# EAGLE design norns-shield-211028 (EAGLE 7.6.0)

## Sheet 1 of 2
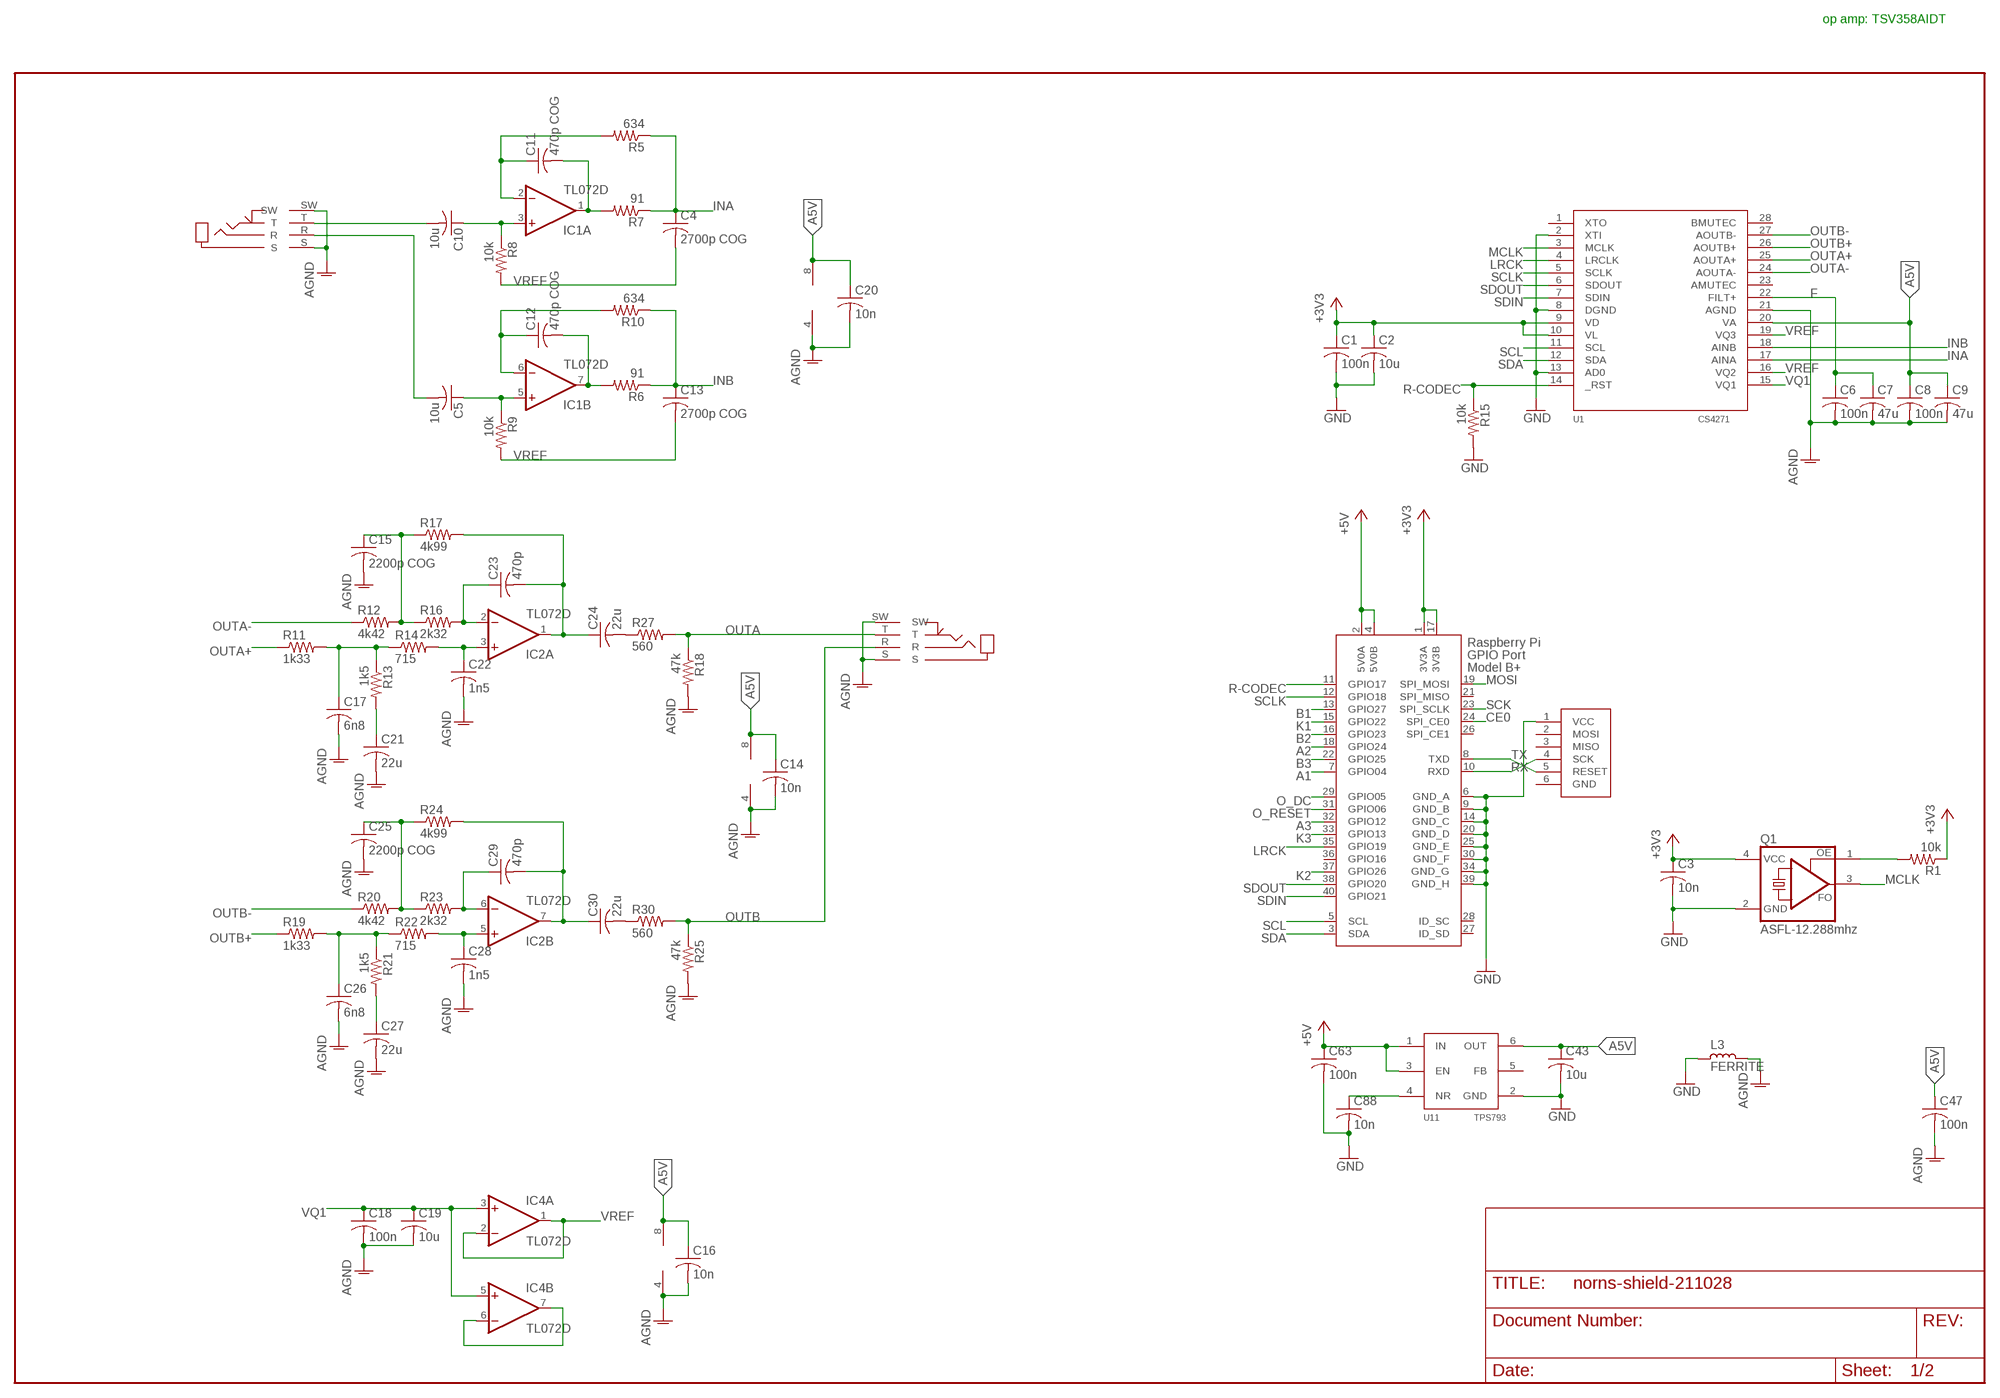
[diagram p0: schematic, sheet 1]

### Parts
C1  100n  C-USC0603  [C0603]
C2  10u  C-USC0805  [C0805]
C3  10n  C-USC0603  [C0603]
C4  2700p COG  C-USC0603  [C0603]
C5  10u  C-USC0805  [C0805]
C6  100n  C-USC0603  [C0603]
C7  47u  C-USC1206  [C1206]
C8  100n  C-USC0603  [C0603]
C9  47u  C-USC1206  [C1206]
C10  10u  C-USC0805  [C0805]
C11  470p COG  C-USC0603  [C0603]
C12  470p COG  C-USC0603  [C0603]
C13  2700p COG  C-USC0603  [C0603]
C14  10n  C-USC0603  [C0603]
C15  2200p COG  C-USC0603  [C0603]
C16  10n  C-USC0603  [C0603]
C17  6n8  C-USC0603  [C0603]
C18  100n  C-USC0603  [C0603]
C19  10u  C-USC0805  [C0805]
C20  10n  C-USC0603  [C0603]
C21  22u  C-USC1206  [C1206]
C22  1n5  C-USC0603  [C0603]
C23  470p  C-USC0603  [C0603]
C24  22u  C-USC1206  [C1206]
C25  2200p COG  C-USC0603  [C0603]
C26  6n8  C-USC0603  [C0603]
C27  22u  C-USC1206  [C1206]
C28  1n5  C-USC0603  [C0603]
C29  470p  C-USC0603  [C0603]
C30  22u  C-USC1206  [C1206]
C43  10u  C-USC0805  [C0805]
C47  100n  C-USC0603  [C0603]
C63  100n  C-USC0603  [C0603]
C88  10n  C-USC0603  [C0603]
IC1  TL072D  [SO08]
IC2  TL072D  [SO08]
IC4  TL072D  [SO08]
J3  ISP-ROW  [ISP-ROW]
J-IN  JACK-TRS-SW  [JACK4832.2330]
J-OUT  JACK-TRS-SW  [JACK4832.2330]
L3  FERRITE  L_0805  [L0805]
Q1  ASFL-12.288mhz  ASFL  [ASF]
R1  10k  R-US_R0603  [R0603]
R5  634  R-US_R0603  [R0603]
R6  91  R-US_R0603  [R0603]
R7  91  R-US_R0603  [R0603]
R8  10k  R-US_R0603  [R0603]
R9  10k  R-US_R0603  [R0603]
R10  634  R-US_R0603  [R0603]
R11  1k33  R-US_R0603  [R0603]
R12  4k42  R-US_R0603  [R0603]
R13  1k5  R-US_R0603  [R0603]
R14  715  R-US_R0603  [R0603]
R15  10k  R-US_R0603  [R0603]
R16  2k32  R-US_R0603  [R0603]
R17  4k99  R-US_R0603  [R0603]
R18  47k  R-US_R0603  [R0603]
R19  1k33  R-US_R0603  [R0603]
R20  4k42  R-US_R0603  [R0603]
R21  1k5  R-US_R0603  [R0603]
R22  715  R-US_R0603  [R0603]
R23  2k32  R-US_R0603  [R0603]
R24  4k99  R-US_R0603  [R0603]
R25  47k  R-US_R0603  [R0603]
R27  560  R-US_R0603  [R0603]
R30  560  R-US_R0603  [R0603]
U1  CS4271  [SOP28]
U11  TPS793  [SSOP6]
X1  RASPI_BOARD_B+#_E3  [RASPI_BOARD_B+_EDGES_3DRILL]

### Nets
+3V3: C1.1 C2.1 C3.1 Q1.4(VCC) R1.1 U1.9(VD) U1.10(VL) X1.1(3V3A) X1.17(3V3B) ; also sheet 2
+5V: C63.1 U11.1(IN) U11.3(EN) X1.2(5V0A) X1.4(5V0B)
A1: X1.7(GPIO04) ; also sheet 2
A2: X1.18(GPIO24) ; also sheet 2
A3: X1.32(GPIO12) ; also sheet 2
A5V: C8.1 C9.1 C14.1 C16.1 C20.1 C43.1 C47.1 IC1.8(P:V+) IC2.8(P:V+) IC4.8(P:V+) U1.20(VA) U11.6(OUT)
AGND: C6.2 C7.2 C8.2 C9.2 C14.2 C15.2 C16.2 C17.2 C18.2 C19.2 C20.2 C21.2 C22.2 C25.2 C26.2 C27.2 C28.2 C47.2 IC1.4(P:V-) IC2.4(P:V-) IC4.4(P:V-) J-IN.S J-IN.SW J-OUT.S J-OUT.SW L3.1 R18.2 R25.2 U1.21(AGND)
B1: X1.13(GPIO27) ; also sheet 2
B2: X1.16(GPIO23) ; also sheet 2
B3: X1.22(GPIO25) ; also sheet 2
CE0: X1.24(SPI_CE0) ; also sheet 2
F: C6.1 C7.1 U1.22(FILT+)
GND: C1.2 C2.2 C3.2 C43.2 C63.2 C88.2 J3.1(VCC) L3.2 Q1.2(GND) R15.2 U1.2(XTI) U1.8(DGND) U1.13(AD0) U11.2(GND) X1.6(GND_A) X1.9(GND_B) X1.14(GND_C) X1.20(GND_D) X1.25(GND_E) X1.30(GND_F) X1.34(GND_G) X1.39(GND_H) ; also sheet 2
INA: C4.1 R5.1 R7.1 U1.17(AINA)
INB: C13.1 R6.1 R10.1 U1.18(AINB)
K1: X1.15(GPIO22) ; also sheet 2
K2: X1.37(GPIO26) ; also sheet 2
K3: X1.33(GPIO13) ; also sheet 2
LRCK: U1.4(LRCLK) X1.35(GPIO19)
MCLK: Q1.3(FO) U1.3(MCLK)
MOSI: X1.19(SPI_MOSI) ; also sheet 2
N$1: Q1.1(OE) R1.2
N$4: C11.1 IC1.2(A:-IN) R5.2
N$5: C11.2 IC1.1(A:OUT) R7.2
N$7: C12.1 IC1.6(B:-IN) R10.2
N$8: C10.2 J-IN.T
N$9: C10.1 IC1.3(A:+IN) R8.1
N$10: C12.2 IC1.7(B:OUT) R6.2
N$11: C5.2 J-IN.R
N$12: C5.1 IC1.5(B:+IN) R9.1
N$13: C24.2 R27.1
N$14: C30.2 R30.1
N$15: C26.1 R19.2 R21.1 R22.1
N$16: C17.1 R11.2 R13.1 R14.1
N$17: C21.1 R13.2
N$20: C15.1 R12.2 R16.1 R17.1
N$21: C23.1 IC2.2(A:-IN) R16.2
N$23: C23.2 C24.1 IC2.1(A:OUT) R17.2
N$24: C22.1 IC2.3(A:+IN) R14.2
N$26: IC4.6(B:-IN) IC4.7(B:OUT)
N$29: C27.1 R21.2
N$30: C25.1 R20.2 R23.1 R24.1
N$31: C29.1 IC2.6(B:-IN) R23.2
N$32: C29.2 C30.1 IC2.7(B:OUT) R24.2
N$33: C28.1 IC2.5(B:+IN) R22.2
N$58: C88.1 U11.4(NR)
O_DC: X1.29(GPIO05) ; also sheet 2
O_RESET: X1.31(GPIO06) ; also sheet 2
OUTA: J-OUT.T R18.1 R27.2
OUTA+: R11.1 U1.25(AOUTA+)
OUTA-: R12.1 U1.24(AOUTA-)
OUTB: J-OUT.R R25.1 R30.2
OUTB+: R19.1 U1.26(AOUTB+)
OUTB-: R20.1 U1.27(AOUTB-)
R-CODEC: R15.1 U1.14(_RST) X1.11(GPIO17)
RX: J3.4(SCK) X1.10(RXD)
SCK: X1.23(SPI_SCLK) ; also sheet 2
SCL: U1.11(SCL) X1.5(SCL)
SCLK: U1.5(SCLK) X1.12(GPIO18)
SDA: U1.12(SDA) X1.3(SDA)
SDIN: U1.7(SDIN) X1.40(GPIO21)
SDOUT: U1.6(SDOUT) X1.38(GPIO20)
TX: J3.5(RESET) X1.8(TXD)
VQ1: C18.1 C19.1 IC4.3(A:+IN) IC4.5(B:+IN) U1.15(VQ1)
VREF: C4.2 C13.2 IC4.1(A:OUT) IC4.2(A:-IN) R8.2 R9.2 U1.16(VQ2) U1.19(VQ3)
Unconnected: J3.2(MOSI) J3.3(MISO) J3.6(GND) U1.1(XTO) U1.23(AMUTEC) U1.28(BMUTEC) U11.5(FB) X1.21(SPI_MISO) X1.26(SPI_CE1) X1.27(ID_SD) X1.28(ID_SC) X1.36(GPIO16)

### Notes on the sheet
- op amp: TSV358AIDT

## Sheet 2 of 2
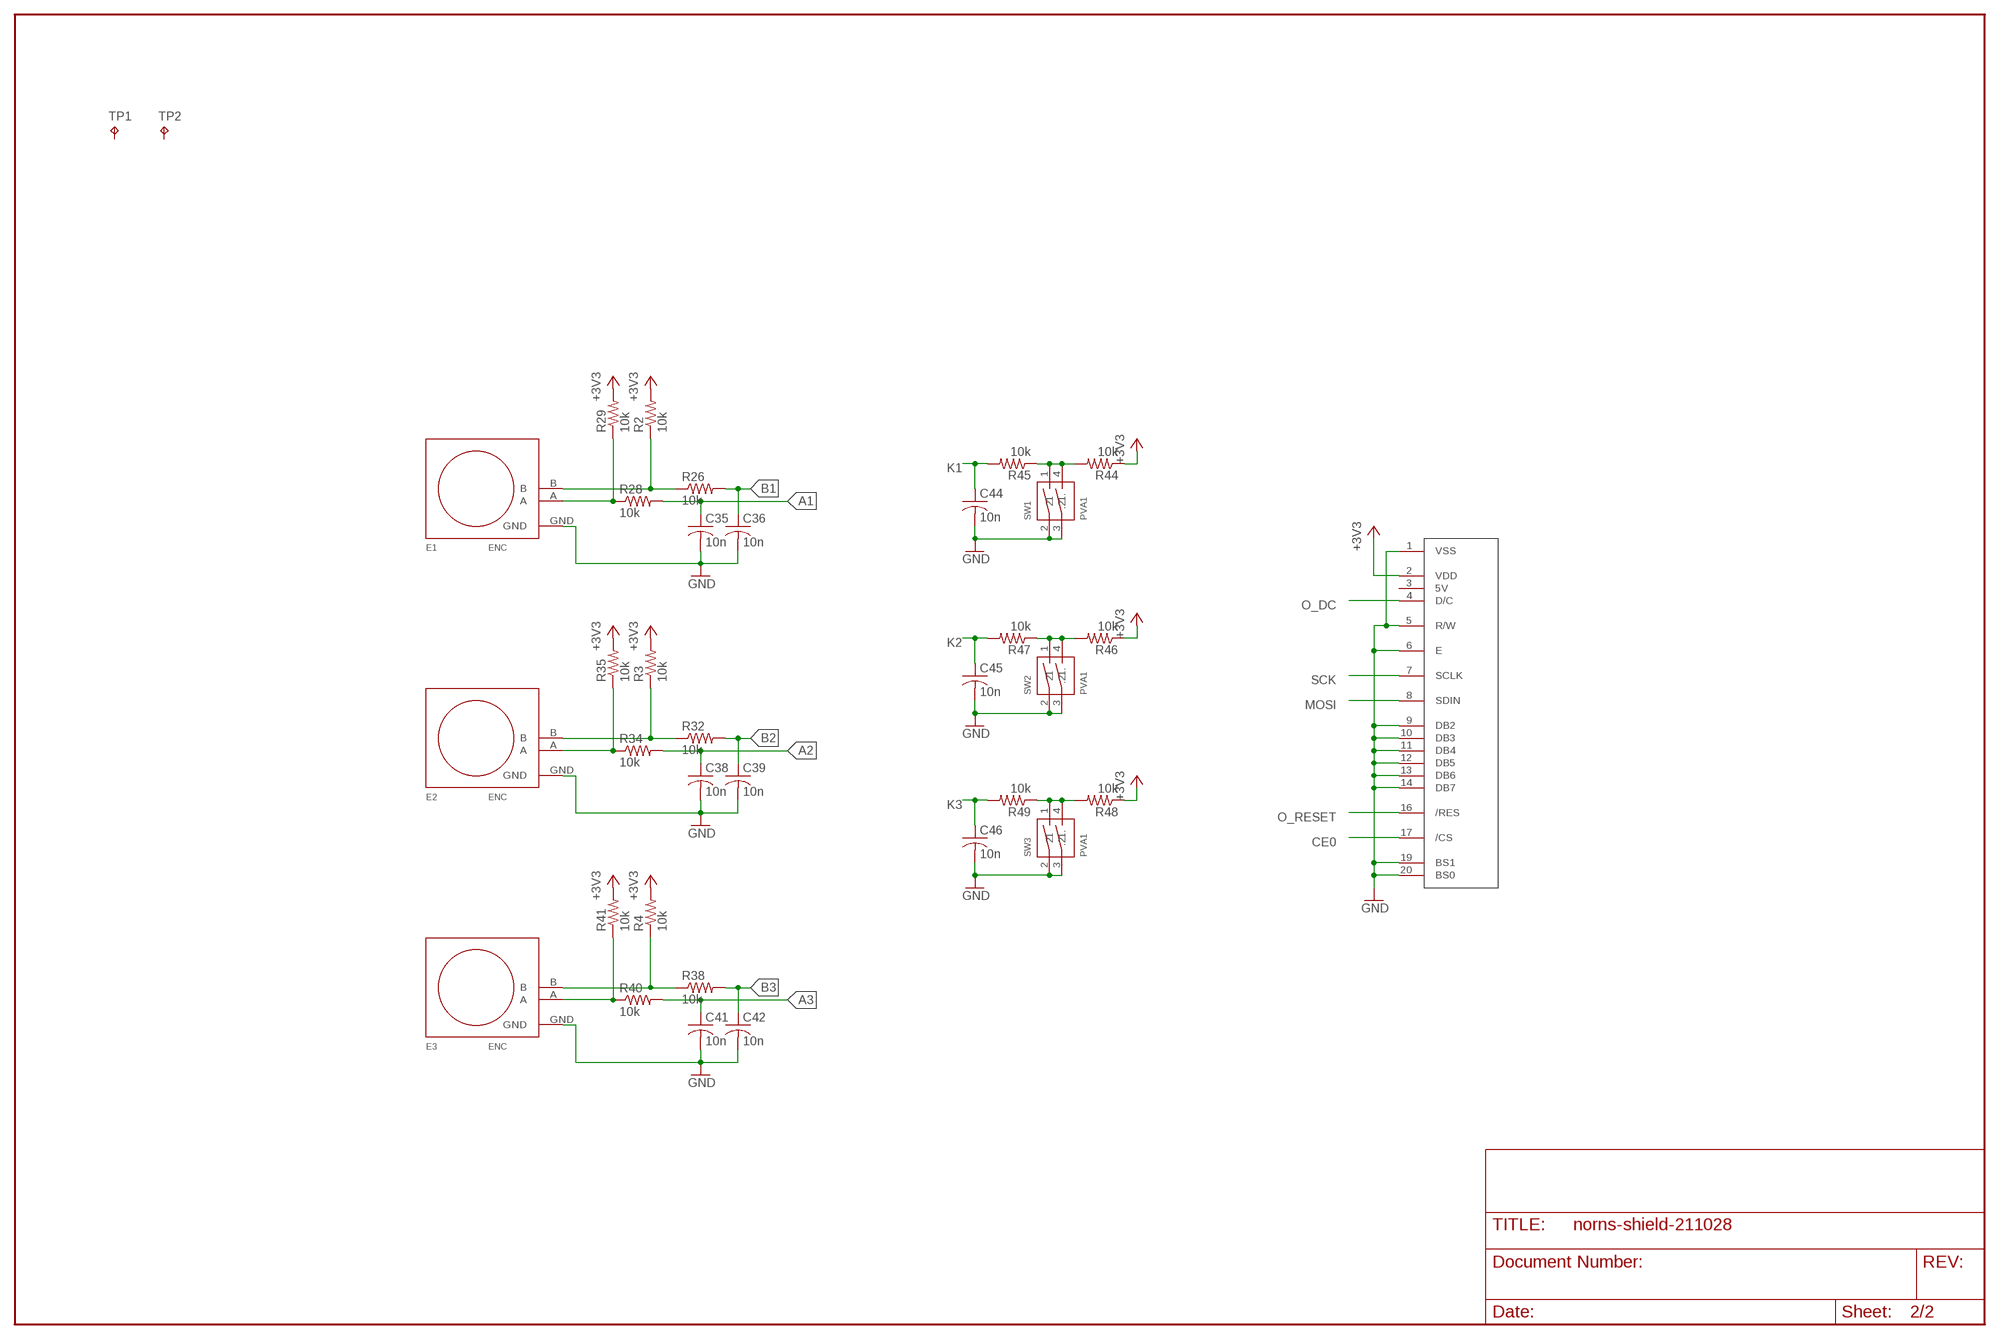
[diagram p1: schematic, sheet 2]

### Parts
C35  10n  C-USC0603  [C0603]
C36  10n  C-USC0603  [C0603]
C38  10n  C-USC0603  [C0603]
C39  10n  C-USC0603  [C0603]
C41  10n  C-USC0603  [C0603]
C42  10n  C-USC0603  [C0603]
C44  10n  C-USC0603  [C0603]
C45  10n  C-USC0603  [C0603]
C46  10n  C-USC0603  [C0603]
E1  ENC  [PEC11RN]
E2  ENC  [PEC11RN]
E3  ENC  [PEC11RN]
R2  10k  R-US_R0603  [R0603]
R3  10k  R-US_R0603  [R0603]
R4  10k  R-US_R0603  [R0603]
R26  10k  R-US_R0603  [R0603]
R28  10k  R-US_R0603  [R0603]
R29  10k  R-US_R0603  [R0603]
R32  10k  R-US_R0603  [R0603]
R34  10k  R-US_R0603  [R0603]
R35  10k  R-US_R0603  [R0603]
R38  10k  R-US_R0603  [R0603]
R40  10k  R-US_R0603  [R0603]
R41  10k  R-US_R0603  [R0603]
R44  10k  R-US_R0603  [R0603]
R45  10k  R-US_R0603  [R0603]
R46  10k  R-US_R0603  [R0603]
R47  10k  R-US_R0603  [R0603]
R48  10k  R-US_R0603  [R0603]
R49  10k  R-US_R0603  [R0603]
SW1  PVA1  [PVA1]
SW2  PVA1  [PVA1]
SW3  PVA1  [PVA1]
TP1  TPB1,27  [B1,27]
TP2  TPB1,27  [B1,27]
U$1  OLED128X64  [OLED-ALEPH]

### Nets
+3V3: R2.2 R3.2 R4.2 R29.2 R35.2 R41.2 R44.1 R46.1 R48.1 U$1.2(VDD) ; also sheet 1
A1: C35.1 R28.2 ; also sheet 1
A2: C38.1 R34.2 ; also sheet 1
A3: C41.1 R40.2 ; also sheet 1
B1: C36.1 R26.2 ; also sheet 1
B2: C39.1 R32.2 ; also sheet 1
B3: C42.1 R38.2 ; also sheet 1
CE0: U$1.17(/CS) ; also sheet 1
GND: C35.2 C36.2 C38.2 C39.2 C41.2 C42.2 C44.2 C45.2 C46.2 E1.GND E2.GND E3.GND SW1.2 SW1.3(1.) SW2.2 SW2.3(1.) SW3.2 SW3.3(1.) U$1.1(VSS) U$1.5(R/W) U$1.6(E) U$1.9(DB2) U$1.10(DB3) U$1.11(DB4) U$1.12(DB5) U$1.13(DB6) U$1.14(DB7) U$1.19(BS1) U$1.20(BS0) ; also sheet 1
K1: C44.1 R45.2 ; also sheet 1
K2: C45.1 R47.2 ; also sheet 1
K3: C46.1 R49.2 ; also sheet 1
MOSI: U$1.8(SDIN) ; also sheet 1
N$2: R44.2 R45.1 SW1.1 SW1.4(.2)
N$3: R46.2 R47.1 SW2.1 SW2.4(.2)
N$6: R48.2 R49.1 SW3.1 SW3.4(.2)
N$18: E1.A R28.1 R29.1
N$19: E1.B R2.1 R26.1
N$22: E2.B R3.1 R32.1
N$25: E2.A R34.1 R35.1
N$27: E3.B R4.1 R38.1
N$28: E3.A R40.1 R41.1
O_DC: U$1.4(D/C) ; also sheet 1
O_RESET: U$1.16(/RES) ; also sheet 1
SCK: U$1.7(SCLK) ; also sheet 1
Unconnected: TP1.TP TP2.TP U$1.3(5V)

## Library data of the parts
C1-C30 C35 C36 C38 C39 C41-C47 C63 C88 = rcl:C-US: CAPACITOR, American symbol
E1-E3 = lines:ENC
IC1 IC2 IC4 = linear:TL072: OP AMP
J3 = monome-inc:ISP-ROW
J-IN J-OUT = lines:JACK-TRS-SW
L3 = rc-master-smd:L_: INDUCTOR
Q1 = crystal:ASF*: CRYSTAL CLOCK OSCILLATORS 5.0 Vdc or 3.3 Vdc - LOW PROFILE ULTRA MINIATURE CERAMIC SURFACE MOUNT Source: http://www.abracon.com/Oscillators/asf1-L-L1.pdf; MPN: ASFLM1-50.000MHZ-C-T; OC_FARNELL: 1838931; OC_NEWARK: 99M0411
R1-R30 R32 R34 R35 R38 R40 R41 R44-R49 = rcl:R-US_: RESISTOR, American symbol
SW1-SW3 = monome-inc:PVA1
TP1 TP2 = testpad:TP: Test pad
U1 = lines:CS4271
U11 = lines:TPS793
U$1 = monome_modular:OLED128X64
X1 = raspberrypi_bastelstube_v13:RASPI_BOARD_B+#: Raspberry Pi GPIO connector with markings for the outer dimensions of the Raspberry Pi board model B+ with different sets of drill holes or mounting pads All pins connected

## Board
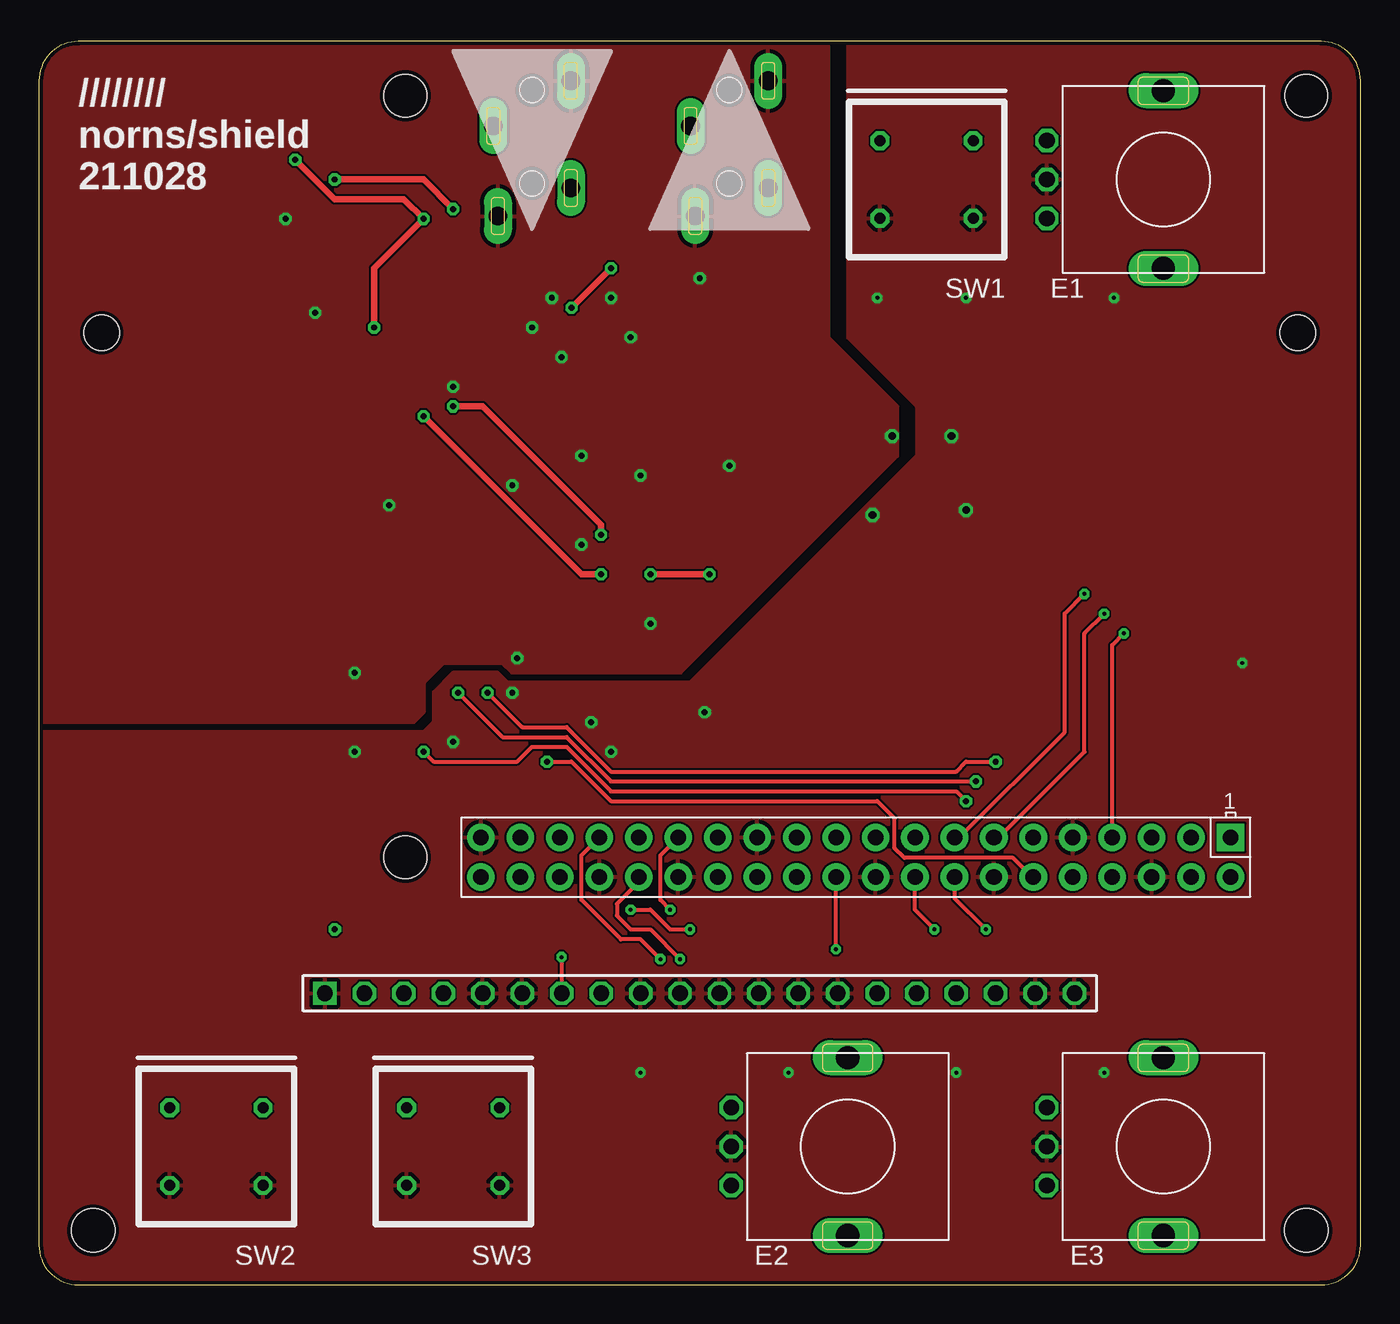
[diagram p2: board, top side]
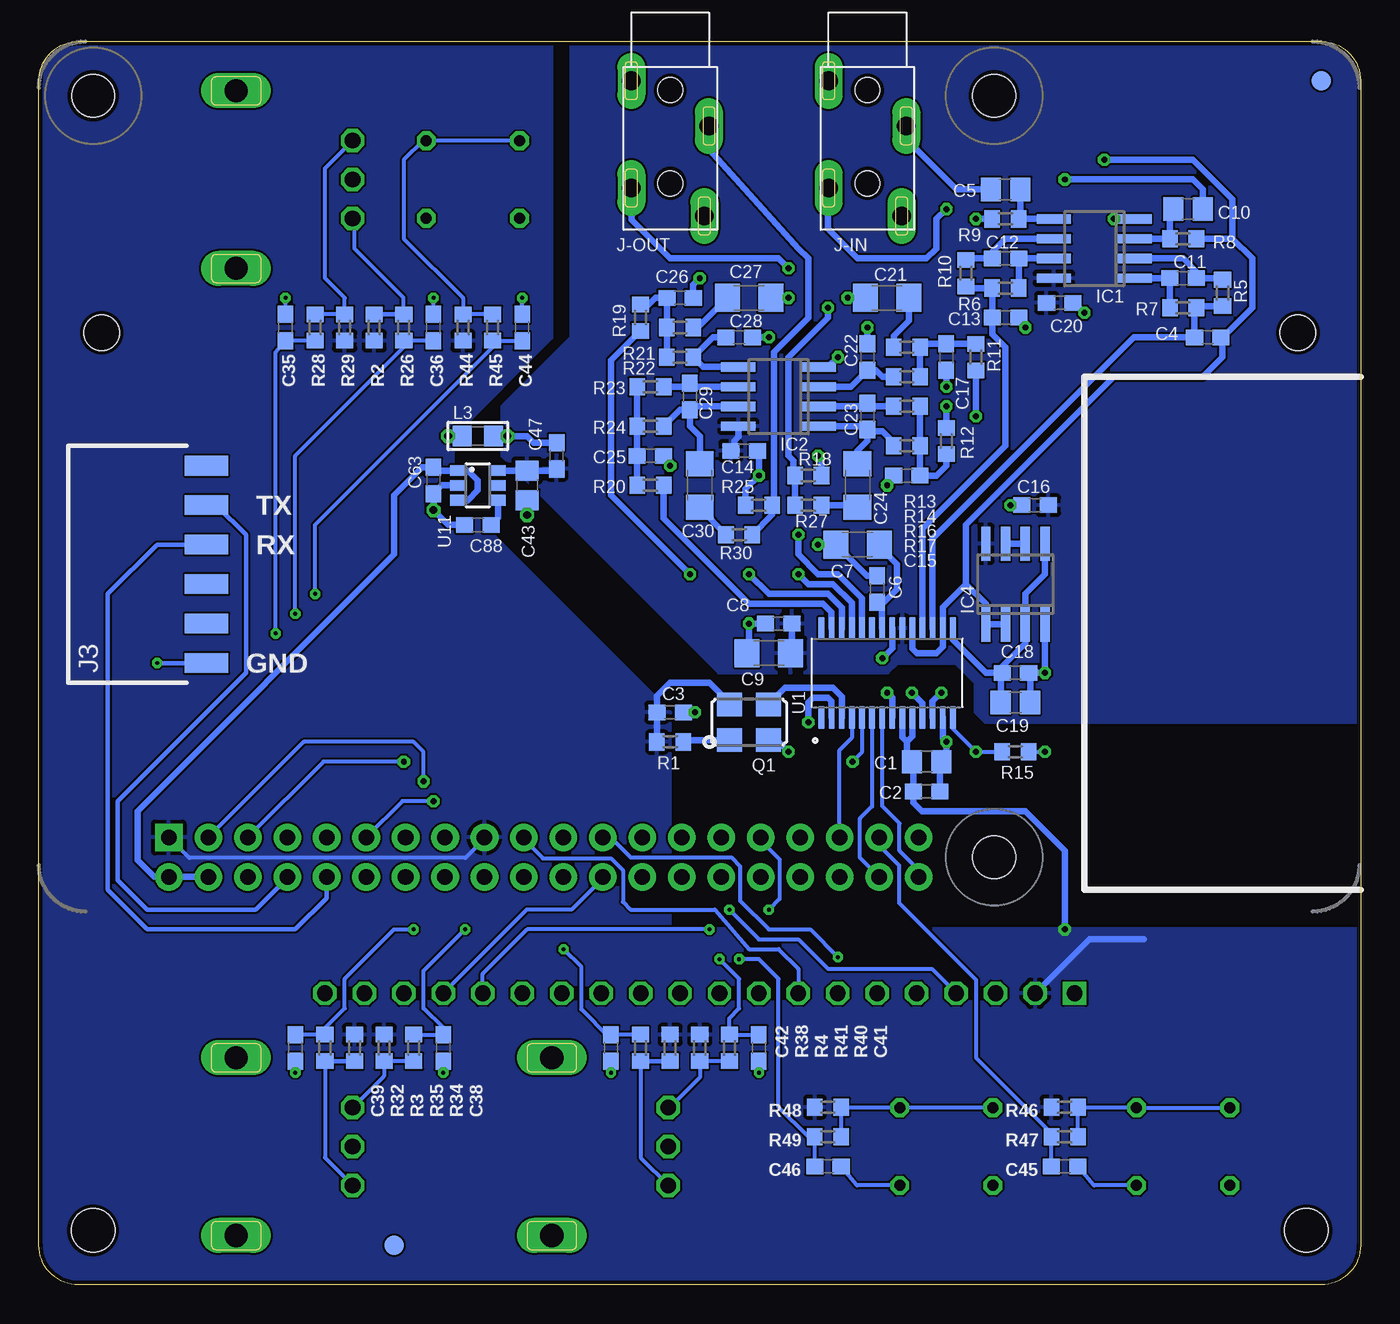
[diagram p3: board, bottom side, seen from below]

Size 85.09 x 80.01 mm. Coordinates in mm from the lower left corner, seen from the top.
Outline: 0,77.47 0,2.54 arc90 2.54,0 82.55,0 arc90 85.09,2.54 85.09,77.47 arc90 82.55,80.01 2.54,80.01 arc90 0,77.47
Copper layers (1*16): Top 0.035mm / dielectric 1.5mm / Bottom 0.035mm
Design rules "default *": minimum track width 8mil, minimum drill 10mil, track to track 5mil, track to pad 5mil, pad to pad 5mil, via to via 5mil, smd to smd 0mil, copper to edge 10mil, drill to drill 8mil, minimum pad ring 10mil, minimum via ring 8mil, stop-mask expansion 4mil, vias tented up to drill 0mil, thermal gap 10mil
Holes 2.8 mm at 81.6,3.49 3.49,3.49

### Footprints (pad centres in the part's own frame; a part is rotated, then mirrored left to right if it is on the bottom)
C0603 = smd 1.1 x 1: 1 -0.85,0; 2 0.85,0
C0805 = smd 1.3 x 1.5: 1 -0.95,0; 2 0.95,0
C1206 = smd 1.6 x 1.8: 1 -1.4,0; 2 1.4,0
PEC11RN = drill 1 octagon: A -2.5,-7.5; B 2.5,-7.5; GND 0,-7.5 | drill 1.5 long: P$1 -5.715,0; P$2 5.715,0
SO08 = smd 0.6 x 2.2: 1 -1.905,-2.6; 2 -0.635,-2.6; 3 0.635,-2.6; 4 1.905,-2.6; 5 1.905,2.6; 6 0.635,2.6; 7 -0.635,2.6; 8 -1.905,2.6
ISP-ROW = smd 1.27 x 2.794: 1 -6.35,0; 2 -3.81,0; 3 -1.27,0; 4 1.27,0; 5 3.81,0; 6 6.35,0
JACK4832.2330 = drill 1.2 long: R -2.5,2.9; S 2.5,0; SW -2.2,8.7; T 2.5,6.9 | hole 1.6: 0,0.6; 0,6.6
L0805 = smd 1.2 x 1.3: 1 -1.016,0; 2 1.016,0
ASF = smd 1.6 x 1.5: 1 -1.25,-1.15; 2 1.25,-1.15; 3 1.25,1.15; 4 -1.25,1.15
R0603 = smd 1 x 1.1: 1 -0.85,0; 2 0.85,0
PVA1 = drill 0.7 octagon: 1 -3,-2.5; 2 -3,2.5; 3 3,2.5; 4 3,-2.5
B1,27 = smd 1.27 x 1.27: TP 0,0
SOP28 = smd 1.49 x 0.41: 1 -2.86,4.225; 2 -2.86,3.575; 3 -2.86,2.925; 4 -2.86,2.275; 5 -2.86,1.625; 6 -2.86,0.975; 7 -2.86,0.325; 8 -2.86,-0.325; 9 -2.86,-0.975; 10 -2.86,-1.625; 11 -2.86,-2.275; 12 -2.86,-2.925; 13 -2.86,-3.575; 14 -2.86,-4.225; 15 2.86,-4.225; 16 2.86,-3.575; 17 2.86,-2.925; 18 2.86,-2.275; 19 2.86,-1.625; 20 2.86,-0.975; 21 2.86,-0.325; 22 2.86,0.325; 23 2.86,0.975; 24 2.86,1.625; 25 2.86,2.275; 26 2.86,2.925; 27 2.86,3.575; 28 2.86,4.225
SSOP6 = smd 0.69 x 0.99: 1 -0.95,-1.3; 2 0,-1.3; 3 0.95,-1.3; 4 0.95,1.3; 5 0,1.3; 6 -0.95,1.3
OLED-ALEPH = drill 1 pad 1.5 square: 1 24.13,21.25 | drill 1 pad 1.5 octagon: 2 21.59,21.25; 3 19.05,21.25; 4 16.51,21.25; 5 13.97,21.25; 6 11.43,21.25; 7 8.89,21.25; 8 6.35,21.25; 9 3.81,21.25; 10 1.27,21.25; 11 -1.27,21.25; 12 -3.81,21.25; 13 -6.35,21.25; 14 -8.89,21.25; 15 -11.43,21.25; 16 -13.97,21.25; 17 -16.51,21.25; 18 -19.05,21.25; 19 -21.59,21.25; 20 -24.13,21.25 | hole 2.286: 38.5,-21.25; -38.5,-21.25
RASPI_BOARD_B+_EDGES_3DRILL = drill 1 pad 1.778 square: 1 8.37,51.23 | drill 1 pad 1.778: 2 8.37,53.77; 3 10.91,51.23; 4 10.91,53.77; 5 13.45,51.23; 6 13.45,53.77; 7 15.99,51.23; 8 15.99,53.77; 9 18.53,51.23; 10 18.53,53.77; 11 21.07,51.23; 12 21.07,53.77; 13 23.61,51.23; 14 23.61,53.77; 15 26.15,51.23; 16 26.15,53.77; 17 28.69,51.23; 18 28.69,53.77; 19 31.23,51.23; 20 31.23,53.77; 21 33.77,51.23; 22 33.77,53.77; 23 36.31,51.23; 24 36.31,53.77; 25 38.85,51.23; 26 38.85,53.77; 27 41.39,51.23; 28 41.39,53.77; 29 43.93,51.23; 30 43.93,53.77; 31 46.47,51.23; 32 46.47,53.77; 33 49.01,51.23; 34 49.01,53.77; 35 51.55,51.23; 36 51.55,53.77; 37 54.09,51.23; 38 54.09,53.77; 39 56.63,51.23; 40 56.63,53.77 | hole 2.75: 3.5,3.5; 61.5,3.5; 61.5,52.5

### Placement (x,y rotation side)
C1  27.94,31.75 0 bottom
C2  27.94,33.66 0 bottom
C3  44.45,36.83 0 bottom
C4  9.84,60.96 0 bottom
C5  22.86,70.48 180 bottom
C6  31.11,44.77 90 bottom
C7  32.38,47.62 180 bottom
C8  37.47,42.55 180 bottom
C9  38.1,40.64 180 bottom
C10  11.11,69.22 0 bottom
C11  11.43,64.77 180 bottom
C12  22.86,66.04 0 bottom
C13  22.86,62.23 0 bottom
C14  39.69,53.66 0 bottom
C15  29.21,52.07 180 bottom
C16  20.95,50.16 180 bottom
C17  26.67,59.69 270 bottom
C18  22.23,39.37 0 bottom
C19  22.23,37.47 0 bottom
C20  19.37,63.18 0 bottom
C21  30.48,63.5 180 bottom
C22  31.75,59.69 90 bottom
C23  31.75,55.88 270 bottom
C24  32.38,51.44 270 bottom
C25  45.72,53.34 0 bottom
C26  43.81,63.5 0 bottom
C27  39.37,63.5 0 bottom
C28  40.01,60.96 0 bottom
C29  43.18,57.15 270 bottom
C30  42.55,51.44 270 bottom
C35  69.22,61.59 90 bottom
C36  59.69,61.59 90 bottom
C38  59.05,15.24 270 bottom
C39  68.58,15.24 270 bottom
C41  38.73,15.24 270 bottom
C42  48.26,15.24 270 bottom
C43  53.66,51.44 270 bottom
C44  53.98,61.59 90 bottom
C45  19.05,7.62 0 bottom
C46  34.29,7.62 0 bottom
C47  51.75,53.34 90 bottom
C63  59.69,51.75 270 bottom
C88  56.83,48.89 180 bottom
E1  72.39,71.12 270 top
E2  72.39,8.89 270 top
E3  52.07,8.89 270 top
IC1  17.14,66.67 90 bottom
IC2  37.47,57.15 90 bottom
IC4  22.23,45.08 0 bottom
J3  74.3,46.36 90 bottom
J-IN  31.75,77.47 180 bottom
J-OUT  44.45,77.47 180 bottom
L3  56.83,54.61 180 bottom
Q1  39.37,36.2 0 bottom
R1  44.45,34.92 0 bottom
R2  63.5,61.59 270 bottom
R3  64.77,15.24 90 bottom
R4  44.45,15.24 90 bottom
R5  8.89,63.82 90 bottom
R6  22.86,64.14 0 bottom
R7  11.43,62.86 180 bottom
R8  11.43,67.31 0 bottom
R9  22.86,68.58 180 bottom
R10  25.4,65.09 90 bottom
R11  24.77,59.69 90 bottom
R12  26.67,54.29 270 bottom
R13  29.21,60.33 180 bottom
R14  29.21,58.42 180 bottom
R15  22.23,34.29 0 bottom
R16  29.21,56.52 180 bottom
R17  29.21,53.97 180 bottom
R18  35.56,52.07 0 bottom
R19  46.35,62.23 90 bottom
R20  45.72,51.44 180 bottom
R21  43.81,61.59 0 bottom
R22  43.81,59.69 0 bottom
R23  45.72,57.78 0 bottom
R24  45.72,55.24 0 bottom
R25  38.73,50.16 180 bottom
R26  61.59,61.59 270 bottom
R27  35.56,50.16 180 bottom
R28  67.31,61.59 270 bottom
R29  65.41,61.59 270 bottom
R30  40.01,48.26 0 bottom
R32  66.67,15.24 90 bottom
R34  60.96,15.24 90 bottom
R35  62.87,15.24 90 bottom
R38  46.35,15.24 90 bottom
R40  40.64,15.24 90 bottom
R41  42.55,15.24 90 bottom
R44  57.78,61.59 90 bottom
R45  55.88,61.59 270 bottom
R46  19.05,11.43 0 bottom
R47  19.05,9.52 180 bottom
R48  34.29,11.43 0 bottom
R49  34.29,9.52 180 bottom
SW1  57.15,71.12 180 top
SW2  11.43,8.89 180 top
SW3  26.67,8.89 180 top
TP1  2.54,77.47 0 bottom
TP2  62.23,2.54 0 bottom
U1  30.48,39.37 90 bottom
U11  56.83,51.44 270 bottom
U$1  42.55,40 180 top
X1  85.09,80.01 180 top

### Tracks (layer width: path | path; a pad name or v marks a point on that pad's centre or on a via)
+3V3  (via drill 0.38)
  Bottom 0.254: X1.1 75.4,27.46 57.63,27.46 56.4,28.69 X1.17
  Bottom 0.406: U1.10 28.86,35.28 29.21,34.92 | 13.97,22.22 17.46,22.22 U$1.2 | U1.9 29.5,35.22 29.21,34.92 | Q1.4 40.62,37.45 41.91,38.73 44.45,38.73 45.3,37.88 C3.1 R1.1 | 29.21,34.92 29.21,33.98 C2.1 28.79,33.55 C1.1 28.79,31.01 28.26,30.48 21.59,30.48 19.05,27.94 v19.05,22.86
  pour Bottom: 0,22.86 44.45,22.86 44.45,36.83 58.42,50.8 58.42,54.61 52.07,60.96 52.07,80.01 85.09,80.01 85.09,0 0,0
+5V
  Bottom 0.406: X1.4 X1.2 77.67,26.24 78.74,27.3 78.74,30.48 62.23,46.99 62.23,50.8 60.43,52.6 C63.1 | 59.69,52.49 C63.1 | C63.1 59.69,52.38 U11.1 57.47,52.38 56.83,51.75 56.83,51.12 57.47,50.48 U11.3
A1  (via drill 0.25)
  Top 0.254: X1.7 69.1,41.16 v69.85,41.91
  Bottom 0.254: R28.2 C35.1 69.85,59.99 v69.85,41.91
A2  (via drill 0.25)
  Top 0.254: v57.66,22.86 56.39,24.13 56.39,26.23 X1.18
  Bottom 0.254: R34.2 C38.1 59.04,16.52 60.33,17.78 60.33,20.19 v57.66,22.86
A3  (via drill 0.25)
  Top 0.254: X1.32 38.62,25.92 37.21,24.51 37.21,23.75 38.1,22.86 39.37,22.86 v41.27,20.95
  Bottom 0.254: C41.1 R40.2 40.64,17.14 40.01,17.78 40.01,19.68 v41.27,20.95
A5V
  Bottom 0.254: 36.81,40.75 C9.1
  Bottom 0.406: U11.6 C43.1 51.86,52.38 C47.1 | C8.1 36.62,40.86 36.83,40.64 36.81,40.75 | IC2.8 40.06,54.55 40.32,54.29 40.32,53.87 C14.1
  pour Bottom: 0,36.2 24.13,36.2 24.77,36.83 24.77,38.73 26.04,40 29.84,40 30.48,39.37 41.27,39.37 55.24,53.34 55.24,56.52 50.8,60.96 50.8,80.01 0,80.01
AGND  (via drill 0.38, 0.5)
  Bottom 0.254: 39.37,40.64 C9.2
  Bottom 0.406: L3.1 v54.93,54.61 53.66,54.61 53.24,54.19 C47.2 | C8.2 v39.37,42.55 39.37,40.64 | C19.2 21.27,39.27 C18.2 v20.32,39.37 IC4.4 | C16.2 v22.54,50.16 | IC1.4 v15.88,68.58 | C20.2 18.41,63.18 v17.78,62.55 | U1.21 30.16,40.95 v30.8,40.32 | C6.2 31.78,45.62 C7.2 v34.92,47.62 | C21.2 v33.02,63.5 | C22.2 v31.75,61.59 | C27.2 v36.83,63.5 | C28.2 v38.1,60.96 | C26.2 42.97,64.35 v42.55,64.77 | IC2.4 34.29,59.05 v33.66,59.69 | C17.2 v26.67,57.78 | C15.2 30.06,51.86 v30.48,51.44 | 38.84,53.44 C14.2 38.73,53.55 v38.73,52.07 39.59,51.22 R25.2 | C25.2 44.87,53.12 v44.45,52.7 | R18.2 34.71,53.12 v34.92,53.34
  pour Top: 50.8,80.01 50.8,60.96 55.24,56.52 55.24,53.34 41.27,39.37 30.48,39.37 29.84,40 26.04,40 24.77,38.73 24.77,36.83 24.13,36.2 0,36.2 0,80.01
B1  (via drill 0.25)
  Top 0.254: X1.13 61.8,28.78 67.31,34.29 67.31,41.91 v68.58,43.18
  Bottom 0.254: C36.1 R26.2 61.59,60.33 68.58,53.34 v68.58,43.18
B2  (via drill 0.25)
  Top 0.254: v60.96,22.86 58.94,24.88 X1.16
  Bottom 0.254: C39.1 R32.2 66.66,16.52 65.41,17.78 65.41,19.68 62.23,22.86 v60.96,22.86
B3  (via drill 0.25)
  Top 0.254: v51.31,21.59 51.31,26.23 X1.22
  Bottom 0.254: R38.2 C42.1 48.34,15.89 50.16,17.72 50.16,20.45 v51.31,21.59
CE0
  Bottom 0.254: X1.24 48.78,26.15 50.8,24.13 53.68,24.13 U$1.17
F
  Bottom 0.406: U1.22 30.8,43.61 C6.1 30.7,43.92 29.84,44.77 29.84,46.36 30.98,47.49 C7.1
GND  (via drill 0.25, 0.38, 0.5)
  Bottom 0.254: C3.2 v42.86,36.83 | C36.2 v59.69,63.5 | C35.2 v69.22,63.5 | C41.2 v38.73,13.65 | C42.2 v48.26,13.65 | C38.2 v59.05,13.65 | C39.2 v68.58,13.65 | C45.2 17.17,6.39 SW2.2 | C46.2 32.41,6.39 SW3.2 | C44.2 53.96,62.25 v53.98,63.5 | R15.2 v20.32,34.29
  Bottom 0.305: J3.1 v77.47,40
  Bottom 0.406: L3.2 v58.74,54.61 | U11.2 59.16,51.44 C63.2 v59.69,49.85 58.74,48.89 C88.2 | C43.2 v53.66,49.53 | 30.17,37.77 v30.48,38.1 30.16,37.77 U1.8 | Q1.2 37.59,35.05 v36.83,34.29 | U1.13 26.91,35.16 v26.67,34.92 26.67,33.98 C2.2 27.09,33.55 C1.2 | U1.2 34.05,37.55 34.29,37.78 35.24,37.78 35.56,37.47 v35.56,36.2
  pour Top: 85.09,0 85.09,80.01 52.07,80.01 52.07,60.96 56.52,56.52 56.52,53.34 41.91,38.73 30.16,38.73 29.53,39.37 26.67,39.37 25.4,38.1 25.4,36.2 24.77,35.56 0,35.56 0,0
INA
  Bottom 0.406: R5.1 10.48,62.97 R7.1 10.69,62.75 C4.1 | U1.17 27.55,48.01 14.61,60.96 C4.1 | 10.79,60.75 C4.1
INB
  Bottom 0.406: R10.1 25.3,64.14 R6.1 C13.1 23.71,61.17 22.86,60.33 22.86,53.97 28.2,48.63 U1.18
K1  (via drill 0.25)
  Top 0.254: X1.15 59.26,28.78 66.04,35.56 66.04,43.18 v67.31,44.45
  Bottom 0.254: C44.1 R45.2 55.88,60.33 67.31,48.89 v67.31,44.45
K2
  Bottom 0.254: C45.1 R47.2 20,9.84 24.77,14.6 24.77,19.62 29.72,24.57 29.72,26.99 31,28.27 X1.37
K3  (via drill 0.25)
  Top 0.254: v40.01,20.95 38.73,22.22 37.47,22.22 34.92,24.77 34.92,27.62 X1.33
  Bottom 0.254: C46.1 R49.2 35.56,9.52 37.47,11.43 37.47,19.68 38.73,20.95 v40.01,20.95
LRCK
  Bottom 0.254: U1.4 32.76,35.19 33.54,34.41 X1.35
MCLK
  Bottom 0.406: U1.3 33.41,37.85 33.97,38.42 37.05,38.42 Q1.3
MOSI
  Bottom 0.254: X1.19 53.86,28.65 52.64,27.43 48.26,27.43 47.5,26.67 47.5,24.64 46.99,24.13 41.57,24.13 39.37,21.59 37.47,21.59 36.2,20.32 U$1.8
N$1
  Bottom 0.406: Q1.1 43.48,35.05 R1.2
N$2
  Bottom 0.254: SW1.4 SW1.1 60.37,73.62 61.59,72.39 61.59,67.31 57.78,63.5 R44.2 R45.1
N$3
  Bottom 0.254: R47.1 R46.2 14.47,11.43 SW2.1 SW2.4
N$4
  Bottom 0.406: IC1.2 11.43,66.04 10.58,65.19 C11.1 8.99,64.77 R5.2
N$5
  Bottom 0.406: IC1.1 C11.2 R7.2
N$6
  Bottom 0.254: R49.1 R48.2 33.6,11.39 SW3.1 SW3.4
N$7
  Bottom 0.406: IC1.6 22.86,67.31 23.71,66.46 C12.1 25.3,66.04 R10.2
N$8  (via drill 0.38)
  Top 0.406: v19.05,71.12 24.77,71.12 v26.67,69.22
  Bottom 0.406: C10.2 10.16,70.49 10.79,71.12 v19.05,71.12 | v26.67,69.22 27.3,68.58 27.3,66.67 27.94,66.04 32.38,66.04 34.29,67.94 34.29,70.53 J-IN.T
N$9
  Bottom 0.406: IC1.3 R8.1 12.28,69 C10.1
N$10
  Bottom 0.406: R6.2 C12.2 IC1.7
N$11
  Bottom 0.406: J-IN.R 29.25,73.7 26.04,70.48 C5.2
N$12
  Bottom 0.406: C5.1 21.91,68.68 R9.1 IC1.5
N$13
  Bottom 0.406: R27.1 32.52,50.16 C24.2
N$14
  Bottom 0.406: C30.2 42.55,49.95 R30.1
N$15
  Bottom 0.406: R22.1 R21.1 C26.1 45.4,63.5 45.82,63.08 R19.2
N$16
  Bottom 0.406: R14.1 R13.1 28.14,60.54 C17.1 R11.2
N$17
  Bottom 0.406: R13.2 30.06,61.06 29.08,62.04 C21.1
N$18
  Bottom 0.254: R28.1 R29.1 65.41,63.5 66.67,64.77 66.67,71.83 E1.A
N$19
  Bottom 0.254: R26.1 61.61,63.52 64.77,66.67 64.77,68.5 E1.B
  Bottom 0.305: R26.1 R2.1
N$20
  Bottom 0.406: R16.1 R17.1 C15.1 27.3,52.07 26.67,52.7 R12.2
N$21
  Bottom 0.406: IC2.2 31.96,56.52 C23.1 31.54,56.52 R16.2
N$22
  Bottom 0.254: R32.1 66.67,8.17 E2.B
  Bottom 0.305: R3.1 R32.1
N$23
  Bottom 0.406: IC2.1 31.96,55.24 C23.2 | C23.2 31.75,54.29 32.38,53.66 C24.1 | R17.2 30.06,54.19 30.8,54.93 31.65,54.93 C23.2
N$24
  Bottom 0.406: IC2.3 32.8,57.78 C22.1 31.22,58.84 30.8,58.42 R14.2
N$25
  Bottom 0.254: R34.1 R35.1 62.87,13.41 E2.A
N$26
  Bottom 0.406: IC4.7 IC4.6
N$27
  Bottom 0.254: R38.1 46.35,8.17 E3.B
  Bottom 0.305: R4.1 R38.1
N$28
  Bottom 0.254: R40.1 R41.1 42.55,13.33 44.45,11.43 44.45,11.51 E3.A
N$29
  Bottom 0.406: R21.2 42.67,61.59 C27.1
N$30
  Bottom 0.406: R23.1 R24.1 C25.1 R20.2
N$31
  Bottom 0.406: IC2.6 42.97,57.78 C29.1 43.4,57.78 R23.2
N$32
  Bottom 0.406: IC2.7 42.97,56.52 C29.2 | C29.2 43.81,56.3 R24.2 | C30.1 42.55,54.61 43.18,55.24 C29.2
N$33
  Bottom 0.406: IC2.5 42.33,59.05 R22.2 41.7,60.96 C28.1
N$58
  Bottom 0.406: U11.4 55.53,49.34 C88.1
O_DC  (via drill 0.25)
  Top 0.254: v40.64,24.13 40.01,24.77 40.01,27.62 X1.29
  Bottom 0.254: v40.64,24.13 38.73,22.22 36.2,22.22 34.29,20.32 27.6,20.32 U$1.4
O_RESET  (via drill 0.25)
  Top 0.254: v38.1,24.13 39.37,24.13 40.64,22.86 v41.91,22.86
  Bottom 0.254: X1.31 38.62,28.59 37.4,27.37 37.4,24.83 v38.1,24.13 | v41.91,22.86 53.66,22.86 56.52,20 U$1.16
OUTA  (via drill 0.38)
  Top 0.406: v36.83,65.41 v34.29,62.86
  Bottom 0.406: J-OUT.T 46.95,68.54 44.45,66.04 37.47,66.04 v36.83,65.41 | v34.29,62.86 34.29,62.23 36.83,59.69 36.83,53.34 36.51,53.02 36.51,52.17 R18.1 R27.2
OUTA+  (via drill 0.38)
  Top 0.406: v36.2,45.72 34.92,45.72 v24.77,55.88
  Bottom 0.406: U1.25 32.76,43.87 33.97,45.08 35.56,45.08 v36.2,45.72 | v24.77,55.88 R11.1
OUTA-  (via drill 0.38)
  Top 0.406: v36.2,48.26 36.2,48.89 28.57,56.52 v26.67,56.52
  Bottom 0.406: U1.24 32.1,44.17 33.66,45.72 34.92,45.72 36.2,46.99 v36.2,48.26 | R12.1 v26.67,56.52
OUTB
  Bottom 0.406: J-OUT.R 41.95,73.06 36.2,66.67 35.56,66.04 35.56,62.23 37.78,60.01 37.78,50.27 R25.1 37.88,49.53 R30.2
OUTB+  (via drill 0.38)
  Top 0.406: v39.37,45.72 v43.18,45.72
  Bottom 0.406: U1.26 33.41,43.56 34.29,44.45 38.1,44.45 v39.37,45.72 | R19.1 48.26,59.47 48.26,50.8 v43.18,45.72
OUTB-
  Bottom 0.406: U1.27 34.05,43.26 34.61,43.81 39.37,43.81 44.87,49.31 R20.1
R-CODEC  (via drill 0.38)
  Top 0.254: v24.77,34.29 25.4,33.66 30.8,33.66 31.75,34.61 33.97,34.61 36.83,31.75 59.05,31.75 v59.69,31.11
  Bottom 0.254: U1.14 26.25,35.78 v24.77,34.29 R15.1 | v59.69,31.11 61.69,31.11 X1.11
RX
  Bottom 0.305: X1.10 66.56,24.88 68.58,22.86 78.11,22.86 80.64,25.4 80.64,44.45 77.47,47.62 J3.4
SCK  (via drill 0.25)
  Top 0.254: v33.66,21.08 U$1.7
  Bottom 0.254: X1.23 48.27,28.78 46.99,27.49 40.51,27.49 39.94,26.92 39.94,24.7 38.1,22.86 35.43,22.86 v33.66,21.08
SCL  (via drill 0.38)
  Top 0.254: v28.89,38.1 31.11,35.88 33.97,35.88 36.83,33.02 59.05,33.02 59.69,33.66 v61.59,33.66
  Bottom 0.254: 71.55,28.78 X1.5 66.77,33.66 v61.59,33.66
  Bottom 0.406: U1.11 28.2,37.41 v28.89,38.1
SCLK  (via drill 0.38)
  Top 0.254: v32.7,33.66 34.29,33.66 36.83,31.11 53.98,31.11 55.09,30 55.09,28.1 55.72,27.46 62.71,27.46 63.93,26.24 X1.12
  Bottom 0.254: U1.5 32.1,34.25 v32.7,33.66
SDA  (via drill 0.38)
  Top 0.254: v26.99,38.1 29.84,35.24 33.97,35.24 36.83,32.38 v60.33,32.38
  Bottom 0.254: 74.09,28.78 X1.3 68.03,34.92 60.96,34.92 60.33,34.29 v60.33,32.38
  Bottom 0.406: U1.12 27.55,37.53 v26.99,38.1
SDIN
  Bottom 0.254: U1.7 30.8,30.8 29.69,29.69 29.69,27.94 28.46,26.72 X1.40
SDOUT
  Bottom 0.254: U1.6 31.45,30.77 32.23,30 32.23,27.47 X1.38
TX
  Bottom 0.305: X1.8 69.1,26.15 71.12,24.13 78.11,24.13 80.01,26.04 80.01,31.11 71.75,39.37 71.75,48.26 73.66,50.16 J3.5
VQ1
  Bottom 0.406: C19.1 23.18,39.27 C18.1 | U1.15 26.25,41.49 24.13,39.37 C18.1 | C18.1 23.07,39.79 21.59,41.27 IC4.3 21.59,44.45 20.32,45.72 IC4.5
VREF  (via drill 0.38)
  Top 0.406: v16.51,72.39 19.05,69.85 23.5,69.85 v24.77,68.58 21.59,65.41 v21.59,61.59
  Bottom 0.406: IC4.2 IC4.1 24.13,43.81 25.4,45.08 | 8.26,67.31 6.99,66.04 6.99,62.86 9.11,60.75 9.21,60.75 C4.2 8.89,60.86 8.89,59.69 10.16,58.42 15.88,58.42 25.4,48.89 25.4,45.08 | 8.26,67.31 R8.2 | R9.2 v24.77,68.58 | v16.51,72.39 10.79,72.39 8.26,69.85 8.26,67.31 | C13.2 22.01,62.02 v21.59,61.59 | U1.19 28.86,40.92 28.57,40.64 27.3,40.64 26.91,41.04 U1.16 26.91,43.58 25.4,45.08

### Text on the board
tPlace: //////// / norns/shield / 211028
bNames: TX | RX | GND